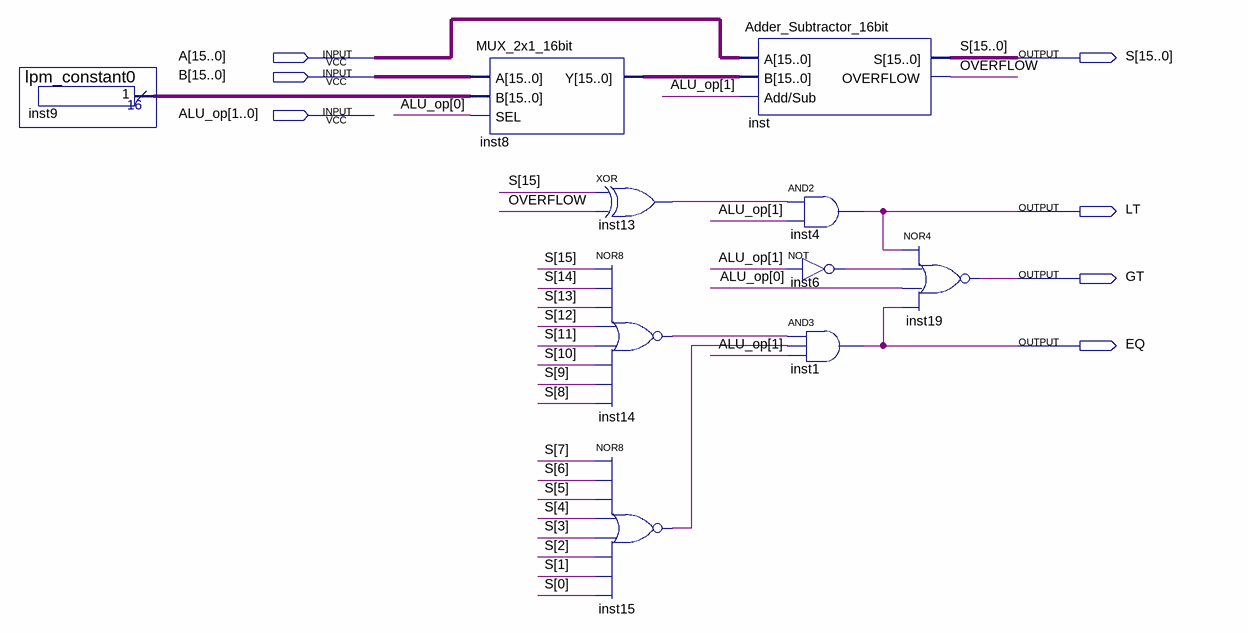
[diagram p0: schematic sheet]
// Quartus schematic AU.bdf as structural Verilog: 10 symbols, 7 pins
module AU (
  input  [15:0] A,
  input  [15:0] B,
  input  [1:0] ALU_op,
  output [15:0] S,
  output LT,
  output GT,
  output EQ
);

  wire inst6_out, inst13_out, inst14_out, inst15_out, OVERFLOW;
  wire [15:0] inst8_y, inst9_result;

  lpm_constant0 inst9 (.result(inst9_result));
  MUX_2x1_16bit inst8 (.A(B), .B(inst9_result), .SEL(ALU_op[0]), .Y(inst8_y));
  xor inst13 (inst13_out, S[15], OVERFLOW);
  nor inst14 (inst14_out, S[15], S[14], S[13], S[12], S[11], S[10], S[9], S[8]);
  nor inst15 (inst15_out, S[7], S[6], S[5], S[4], S[3], S[2], S[1], S[0]);
  Adder_Subtractor_16bit inst (.A(A), .B(inst8_y), .\Add/Sub (ALU_op[1]), .S(S), .OVERFLOW(OVERFLOW));
  and inst4 (LT, inst13_out, ALU_op[1]);
  not inst6 (inst6_out, ALU_op[1]);
  and inst1 (EQ, inst14_out, inst15_out, ALU_op[1]);
  nor inst19 (GT, LT, inst6_out, ALU_op[0], EQ);
endmodule
